# EAGLE design Mixer-Analog-OPA1644-Rev-E_TH_remaining02 (EAGLE 8.5.0)
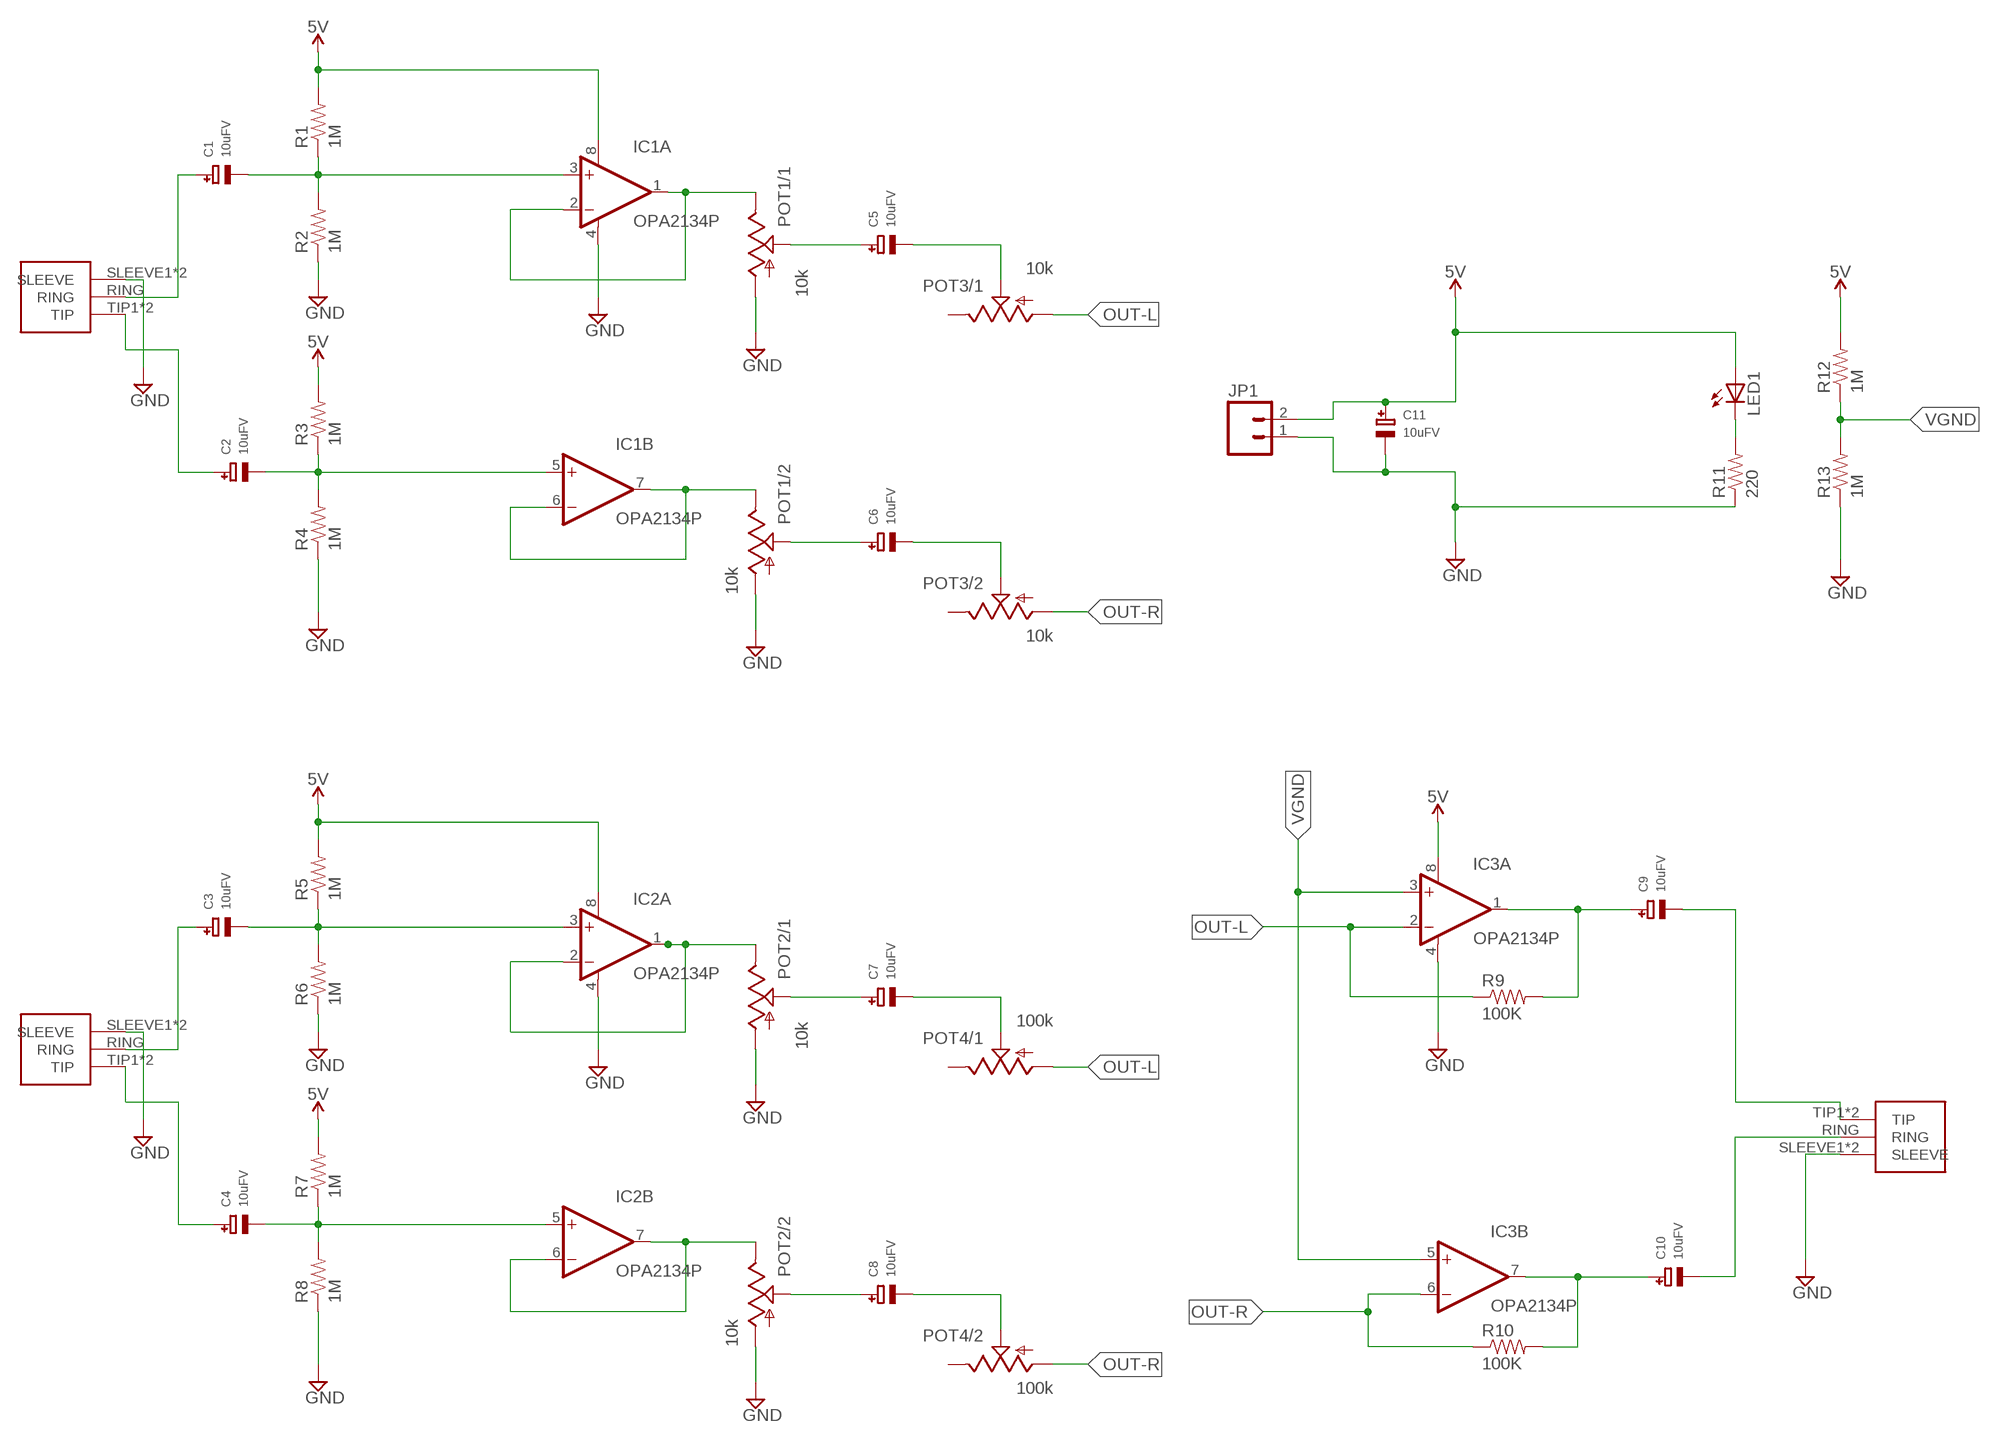
[diagram p0: schematic, sheet 1]

## Parts
C1  10uFV  CAP_ELECTROLYTICPTH_3.5MMGRID_8MMDIA  [CELEC_3.5MM_8MM]
C2  10uFV  CAP_ELECTROLYTICPTH_3.5MMGRID_8MMDIA  [CELEC_3.5MM_8MM]
C3  10uFV  CAP_ELECTROLYTICPTH_3.5MMGRID_8MMDIA  [CELEC_3.5MM_8MM]
C4  10uFV  CAP_ELECTROLYTICPTH_3.5MMGRID_8MMDIA  [CELEC_3.5MM_8MM]
C5  10uFV  CAP_ELECTROLYTICPTH_3.5MMGRID_8MMDIA  [CELEC_3.5MM_8MM]
C6  10uFV  CAP_ELECTROLYTICPTH_3.5MMGRID_8MMDIA  [CELEC_3.5MM_8MM]
C7  10uFV  CAP_ELECTROLYTICPTH_3.5MMGRID_8MMDIA  [CELEC_3.5MM_8MM]
C8  10uFV  CAP_ELECTROLYTICPTH_3.5MMGRID_8MMDIA  [CELEC_3.5MM_8MM]
C9  10uFV  CAP_ELECTROLYTICPTH_3.5MMGRID_8MMDIA  [CELEC_3.5MM_8MM]
C10  10uFV  CAP_ELECTROLYTICPTH_3.5MMGRID_8MMDIA  [CELEC_3.5MM_8MM]
C11  10uFV  CAP_ELECTROLYTICPTH_3.5MMGRID_8MMDIA  [CELEC_3.5MM_8MM]
IC1  OPA2134P  [DIL08]
IC2  OPA2134P  [DIL08]
IC3  OPA2134P  [DIL08]
J1  1/8"-F-STEREO-PCB  [1/8"-F-STEREO-PCB]
J2  1/8"-F-STEREO-PCB  [1/8"-F-STEREO-PCB]
J3  1/8"-F-STEREO-PCB  [1/8"-F-STEREO-PCB]
JP1  M02LOCK  [1X02_LOCK]
LED1  LED3MM  [LED3MM]
POT1  10k  POT-DUAL-PTV112-4420  [PTV112]
POT2  10k  POT-DUAL-PTV112-4420  [PTV112]
POT3  10k  POT-DUAL-PTV112-4420  [PTV112]
POT4  100k  POT-DUAL-PTV112-4420  [PTV112]
R1  1M  RESISTOREZ  [AXIAL-0.3EZ]
R2  1M  RESISTORAXIAL-0.3  [AXIAL-0.3]
R3  1M  RESISTOREZ  [AXIAL-0.3EZ]
R4  1M  RESISTOREZ  [AXIAL-0.3EZ]
R5  1M  RESISTOREZ  [AXIAL-0.3EZ]
R6  1M  RESISTOREZ  [AXIAL-0.3EZ]
R7  1M  RESISTOREZ  [AXIAL-0.3EZ]
R8  1M  RESISTOREZ  [AXIAL-0.3EZ]
R9  100K  RESISTOREZ  [AXIAL-0.3EZ]
R10  100K  RESISTOREZ  [AXIAL-0.3EZ]
R11  220  RESISTOREZ  [AXIAL-0.3EZ]
R12  1M  RESISTOREZ  [AXIAL-0.3EZ]
R13  1M  RESISTOREZ  [AXIAL-0.3EZ]

## Nets
5V: C11.+ IC1.8(A:V+) IC2.8(A:V+) IC3.8(A:V+) JP1.2 LED1.A R1.P$2 R3.P$2 R5.P$2 R7.P$2 R12.P$2
DLE: IC1.1(A:OUT) IC1.2(A:-IN) POT1.1.3(/1:E)
GND: C11.- IC1.4(A:V-) IC2.4(A:V-) IC3.4(A:V-) J1.SLEEVE1(SLEEVE) J1.SLEEVE2(SLEEVE) J2.SLEEVE1(SLEEVE) J2.SLEEVE2(SLEEVE) J3.SLEEVE1(SLEEVE) J3.SLEEVE2(SLEEVE) JP1.1 POT1.1.1(/1:A) POT1.2.1(/2:A) POT2.1.1(/1:A) POT2.2.1(/2:A) R2.P$1 R4.P$1 R6.P$1 R8.P$1 R11.P$1 R13.P$1
N$2: C5.- POT3.1.2(/1:S)
N$3: C2.- IC1.5(B:+IN) R3.P$1 R4.P$2
N$4: C6.+ POT1.2.2(/2:S)
N$5: C1.+ J1.RING
N$6: C6.- POT3.2.2(/2:S)
N$7: C9.+ IC3.1(A:OUT) R9.P$2
N$8: IC2.6(B:-IN) IC2.7(B:OUT) POT2.2.3(/2:E)
N$9: C2.+ J1.TIP1(TIP) J1.TIP2(TIP)
N$10: C7.- POT4.1.2(/1:S)
N$11: C8.- POT4.2.2(/2:S)
N$12: C4.- IC2.5(B:+IN) R7.P$1 R8.P$2
N$13: C3.+ J2.RING
N$14: C4.+ J2.TIP1(TIP) J2.TIP2(TIP)
N$15: LED1.K(C) R11.P$2
N$16: C7.+ POT2.1.2(/1:S)
N$17: C10.+ IC3.7(B:OUT) R10.P$2
N$20: C8.+ POT2.2.2(/2:S)
N$24: IC1.6(B:-IN) IC1.7(B:OUT) POT1.2.3(/2:E)
N$43: IC2.1(A:OUT) IC2.2(A:-IN) POT2.1.3(/1:E)
N$54: C3.- IC2.3(A:+IN) R5.P$1 R6.P$2
N$55: C1.- IC1.3(A:+IN) R1.P$1 R2.P$2
N$61: C9.- J3.TIP1(TIP) J3.TIP2(TIP)
N$62: C10.- J3.RING
OUT-L: IC3.2(A:-IN) POT3.1.1(/1:A) POT4.1.1(/1:A) R9.P$1
OUT-R: IC3.6(B:-IN) POT3.2.1(/2:A) POT4.2.1(/2:A) R10.P$1
POT1: C5.+ POT1.1.2(/1:S)
VGND: IC3.3(A:+IN) IC3.5(B:+IN) R12.P$1 R13.P$2
Unconnected: POT3.1.3(/1:E) POT3.2.3(/2:E) POT4.1.3(/1:E) POT4.2.3(/2:E)

## Library data of the parts
C1-C11 = microbuilder:CAP_ELECTROLYTIC: Electrolytic Capacitors SMT PANASONIC_C - Size C Panasonic Electrolytic Aluminum Capacitor 47µF 16V 20% Electrolytic Capacitor [Digikey: PCE3890TR-ND] PANASONIC_D - Size D Panasonic Electrolytic Aluminum Capacitor 100µF 25V 20% Electrolytic Capacitor [Digikey: PCE3898TR-ND] PTH 3.5 mm grid, 8 mm diameter ... 3.5 mm grid, 10 mm diameter ...
IC1-IC3 = burr-brown:OPA2134: Operational Amplifier; MF: TEXAS INSTRUMENTS; MPN: OPA2134PA; OC_FARNELL: 1097574; OC_NEWARK: 74K3897
J1-J3 = CMU-ArtFab:1/8"-F-STEREO-PCB
JP1 = CMU-ArtFab:M02: Header 2 Standard 2-pin 0.1" header. Use with straight break away headers (SKU : PRT-00116), right angle break away headers (PRT-00553), swiss pins (PRT-00743), machine pins (PRT-00117), and female headers (PRT-00115). Molex polarized connector foot print use with SKU : PRT-08233 with associated crimp pins and housings.
LED1 = led:LED: LED OSRAM: - CHIPLED LG R971, LG N971, LY N971, LG Q971, LY Q971, LO R971, LY R971 LH N974, LH R974 LS Q976, LO Q976, LY Q976 LO Q996 - Hyper CHIPLED LW Q18S LB Q993, LB Q99A, LB R99A - SideLED LS A670, LO A670, LY A670, LG A670, LP A670 LB A673, LV A673, LT A673, LW A673 LH A674 LY A675 LS A676, LA A676, LO A676, LY A676, LW A676 LS A679, LY A679, LG A679 - Hyper Micro SIDELED® LS Y876, LA Y876, LO Y876, LY Y876 LT Y87S - SmartLED LW L88C, LW L88S LB L89C, LB L89S, LG L890 LS L89K, LO L89K, LY L89K LS L896, LA L896, LO L896, LY L896 - TOPLED LS T670, LO T670, LY T670, LG T670, LP T670 LSG T670, LSP T670, LSY T670, LOP T670, LYG T670 LG T671, LOG T671, LSG T671 LB T673, LV T673, LT T673, LW T673 LH T674 LS T676, LA T676, LO T676, LY T676, LB T676, LH T676, LSB T676, LW T676 LB T67C, LV T67C, LT T67C, LS T67K, LO T67K, LY T67K, LW E67C LS E67B, LA E67B, LO E67B, LY E67B, LB E67C, LV E67C, LT E67C LW T67C LS T679, LY T679, LG T679 LS T770, LO T770, LY T770, LG T770, LP T770 LB T773, LV T773, LT T773, LW T773 LH T774 LS E675, LA E675, LY E675, LS T675 LS T776, LA T776, LO T776, LY T776, LB T776 LHGB T686 LT T68C, LB T68C - Hyper Mini TOPLED® LB M676 - Mini TOPLED Santana® LG M470 LS M47K, LO M47K, LY M47K Source: http://www.osram.convergy.de LUXEON: - LUMILED® LXK2-PW12-R00, LXK2-PW12-S00, LXK2-PW14-U00, LXK2-PW14-V00 LXK2-PM12-R00, LXK2-PM12-S00, LXK2-PM14-U00 LXK2-PE12-Q00, LXK2-PE12-R00, LXK2-PE12-S00, LXK2-PE14-T00, LXK2-PE14-U00 LXK2-PB12-K00, LXK2-PB12-L00, LXK2-PB12-M00, LXK2-PB14-N00, LXK2-PB14-P00, LXK2-PB14-Q00 LXK2-PR12-L00, LXK2-PR12-M00, LXK2-PR14-Q00, LXK2-PR14-R00 LXK2-PD12-Q00, LXK2-PD12-R00, LXK2-PD12-S00 LXK2-PH12-R00, LXK2-PH12-S00 LXK2-PL12-P00, LXK2-PL12-Q00, LXK2-PL12-R00 Source: www.luxeon.com KINGBRIGHT: KA-3528ASYC Source: www.kingbright.com
POT1-POT4 = CMU-ArtFab:POT-DUAL-PTV112: Bourns 11mm dual potentiometer; AVAILABILITY: Unavailable; DESCRIPTION: Alt# Tce-10111410; MF: STMicroelectronics; MP: PTV112; PACKAGE: None; PRICE: None; SPICEPREFIX: J
R1-R10 = SparkFun-Passives:RESISTOR: Resistor Basic schematic elements and footprints for 0603, 1206, and PTH resistors.; SPICEPREFIX: R
R11-R13 = SparkFun-Passives:RESISTOR: Resistor Basic schematic elements and footprints for 0603, 1206, and PTH resistors.

## Board
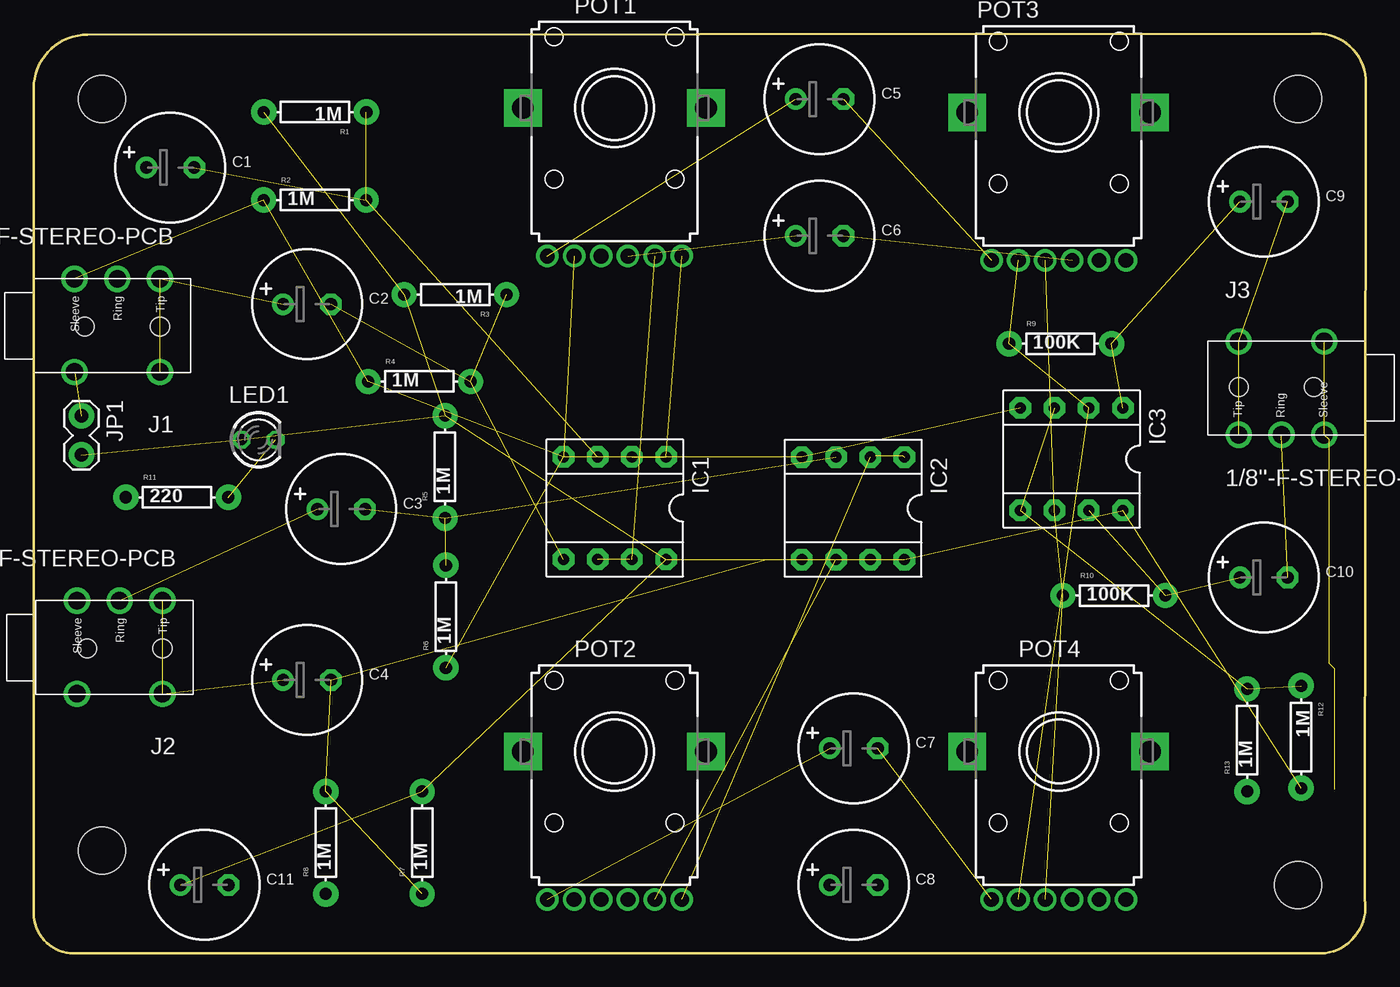
[diagram p1: board, top side]
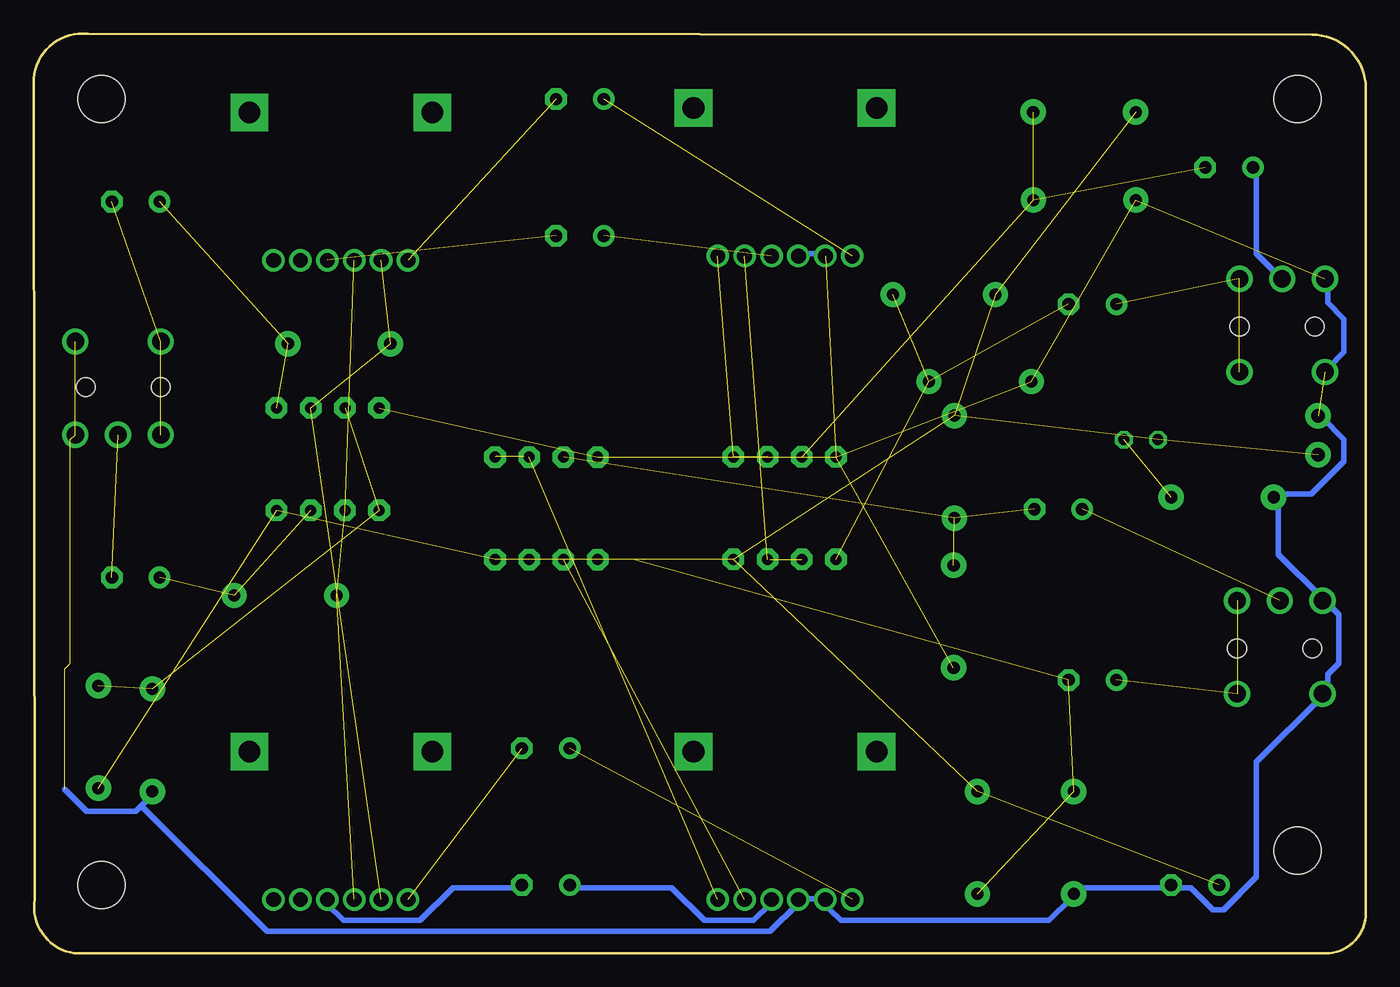
[diagram p2: board, bottom side, seen from below]

Size 99.03 x 68.37 mm. Coordinates in mm from the lower left corner, seen from the top.
Outline: 0,3 arc90 3,0 96,0 arc90 98.96,4 99.01,64.35 arc103 95.01,68.35 4,68.3 arc90 0,64.3 0,3
Copper layers (1*16): Top 0.035mm / dielectric 1.5mm / Bottom 0.035mm
Design rules "default *": minimum track width 16mil, minimum drill 0.35mm, track to track 16mil, track to pad 20mil, pad to pad 16mil, via to via 16mil, smd to smd 16mil, copper to edge 40mil, drill to drill 6mil, minimum pad ring 10mil, minimum via ring 8mil, stop-mask expansion 4mil, vias tented up to drill 0mil, thermal gap 10mil
Holes 3.5 mm at 93.98,63.5 5.08,63.5 93.98,5.08 5.08,7.62

### Footprints (pad centres in the part's own frame; a part is rotated, then mirrored left to right if it is on the bottom)
CELEC_3.5MM_8MM = drill 0.914 pad 1.6: + -1.778,0 | drill 0.914 pad 1.6 octagon: - 1.778,0
DIL08 = drill 0.813 pad 1.6 octagon: 1 -3.81,-3.81; 2 -1.27,-3.81; 3 1.27,-3.81; 4 3.81,-3.81; 5 3.81,3.81; 6 1.27,3.81; 7 -1.27,3.81; 8 -3.81,3.81
1/8"-F-STEREO-PCB = drill 1.3: RING 5.461,0; SLEEVE1 8.636,6.934; SLEEVE2 8.636,0; TIP1 2.286,6.934; TIP2 2.286,0 | hole 1.4: 2.286,3.556; 7.874,3.556
1X02_LOCK = drill 1.016 pad 1.88: 1 -0.178,0; 2 2.718,0
LED3MM = drill 0.813 octagon: A -1.27,0; K 1.27,0
PTV112 = drill 1.1 pad 1.676: 1.1 -3,-11; 1.2 -5,-11; 1.3 5,-11; 2.1 -1,-11; 2.2 1,-11; 2.3 3,-11 | drill 1.6 pad 2.8 square: M1 -6.8,0; M2 6.8,0
AXIAL-0.3EZ = drill 0.9 pad 1.88: P$1 -3.81,0; P$2 3.81,0
AXIAL-0.3 = drill 0.9 pad 1.88: P$1 -3.81,0; P$2 3.81,0

### Placement (x,y rotation side)
C1  10.16,58.42 0 top
C2  20.32,48.26 0 top
C3  22.86,33.02 0 top
C4  20.32,20.32 0 top
C5  58.42,63.5 0 top
C6  58.42,53.34 0 top
C7  60.96,15.24 0 top
C8  60.96,5.08 0 top
C9  91.44,55.88 0 top
C10  91.44,27.94 0 top
C11  12.7,5.08 0 top
IC1  43.2,33.1 180 top
IC2  60.92,33.08 180 top
IC3  77.16,36.74 180 top
J1  11.68,50.15 180 top
J2  11.86,26.22 180 top
J3  87.3,38.54 0 top
JP1  3.55,39.78 270 top
LED1  16.72,38.18 0 top
POT1  43.18,62.84 0 top
POT2  43.18,15 0 top
POT3  76.2,62.52 0 top
POT4  76.2,15 0 top
R1  20.92,62.54 180 top
R2  20.91,56 0 top
R3  31.35,48.97 180 top
R4  28.67,42.51 0 top
R5  30.58,36.16 90 top
R6  30.64,25.03 90 top
R7  28.88,8.22 90 top
R8  21.72,8.22 90 top
R9  76.32,45.32 0 top
R10  80.32,26.6 0 top
R11  10.66,33.9 0 top
R12  94.22,16.08 270 top
R13  90.21,15.84 90 top

### Tracks (layer width: path | path; a pad name or v marks a point on that pad's centre or on a via)
5V  (10 unrouted)
DLE  (2 unrouted)
GND  (13 unrouted)
  Bottom 0.406: POT1.2.1 41.86,52.02 40.23,52.02 POT1.1.1 | 96.72,12.19 95.1,10.57 91.44,10.57 91.03,10.97 | 91.03,10.97 90.22,11.79 R13.P$1 | J1.SLEEVE2 2.85,49.99 2.85,48.36 1.63,47.14 1.63,44.7 2.85,43.48 J1.SLEEVE1 | JP1.1 3.25,39.83 1.63,38.2 1.63,36.58 4.06,34.14 6.5,34.14 R11.P$1 6.5,33.73 6.5,29.67 3.25,26.42 J2.SLEEVE2 2.85,26.01 2.03,25.2 2.03,21.54 2.85,20.73 2.85,19.51 J2.SLEEVE1 3.25,19.1 8.13,14.22 8.13,5.69 10.57,3.25 11.38,3.25 13.01,4.88 14.22,4.88 C11.- 14.63,4.88 21.13,4.88 21.54,4.47 R8.P$1 21.95,4.06 23.57,2.44 39.01,2.44 39.83,3.25 39.83,3.66 POT2.1.1 40.23,4.06 41.86,4.06 POT2.2.1 42.27,3.66 44.3,1.63 81.69,1.63 91.03,10.97
N$2  (1 unrouted)
N$3  (3 unrouted)
N$4  (1 unrouted)
N$5
  Bottom 0.406: C1.+ 8.13,58.12 8.13,52.02 6.5,50.39 J1.RING
N$6  (1 unrouted)
N$7  (2 unrouted)
N$8  (2 unrouted)
N$9  (2 unrouted)
N$10  (1 unrouted)
N$11
  Bottom 0.406: C8.- 62.99,4.88 67.87,4.88 70.31,2.44 76,2.44 77.22,3.66 POT4.2.2
N$12  (4 unrouted)
  Bottom 0.406: 56.9,29.26 IC2.5 | 29.26,4.06 R7.P$1
N$13  (1 unrouted)
N$14  (2 unrouted)
N$15  (1 unrouted)
N$16  (1 unrouted)
N$17  (2 unrouted)
N$20
  Bottom 0.406: C8.+ 58.93,4.88 51.61,4.88 49.17,2.44 45.52,2.44 44.3,3.66 POT2.2.2
N$24  (3 unrouted)
  Bottom 0.406: 44.3,29.26 IC1.7
N$43  (3 unrouted)
  Bottom 0.406: 62.59,36.98 IC2.2
N$54  (3 unrouted)
N$55  (3 unrouted)
N$61  (2 unrouted)
N$62  (1 unrouted)
OUT-L  (3 unrouted)
OUT-R  (3 unrouted)
POT1  (1 unrouted)
VGND  (3 unrouted)